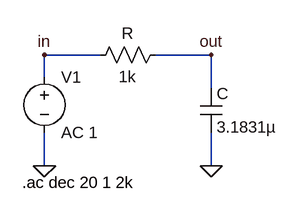
[diagram p0: schematic RC_lowpass Filter.asc]
RC_lowpass Filter.asc, the LTspice schematic file:
Version 4
SHEET 1 880 680
WIRE 112 32 32 32
WIRE 272 32 192 32
WIRE 32 64 32 32
WIRE 272 80 272 32
WIRE 32 192 32 144
WIRE 272 192 272 144
FLAG 32 192 0
FLAG 272 192 0
FLAG 272 32 out
FLAG 32 32 in
SYMBOL cap 256 80 R0
SYMATTR InstName C
SYMATTR Value 3.1831µ
SYMBOL res 208 16 R90
WINDOW 0 0 56 VBottom 2
WINDOW 3 32 56 VTop 2
SYMATTR InstName R
SYMATTR Value 1k
SYMBOL voltage 32 48 R0
SYMATTR InstName V1
SYMATTR Value AC 1
TEXT 0 216 Left 2 !.ac dec 20 1 2k

The netlist it stands for:
* RC_lowpass Filter.asc
C out 0 3.1831µ
R out in 1k
V1 in 0 AC 1
.ac dec 20 1 2k
.backanno
.end

* Results of the author's LTspice run, read from the files saved beside the schematic
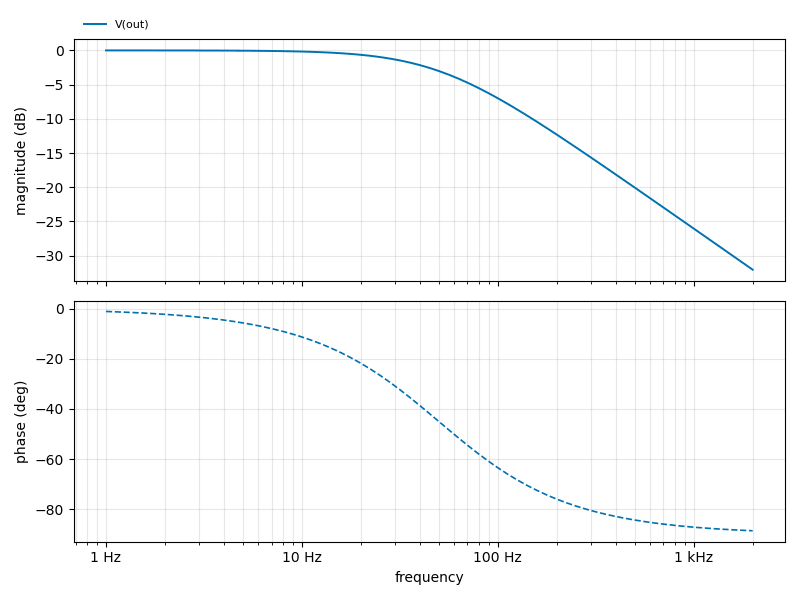
[diagram p1: AC Analysis of RC_lowpass Filter.asc, plotted from the saved traces]
* AC Analysis, 1 run:
*   V(out): -0.00 dB at 1 Hz, -32.04 dB at 2 kHz, peak -0.00 dB at 1 Hz, 3 dB below the peak at 50.01 Hz